# EAGLE design Displayduino_2_0 (EAGLE 4.16)
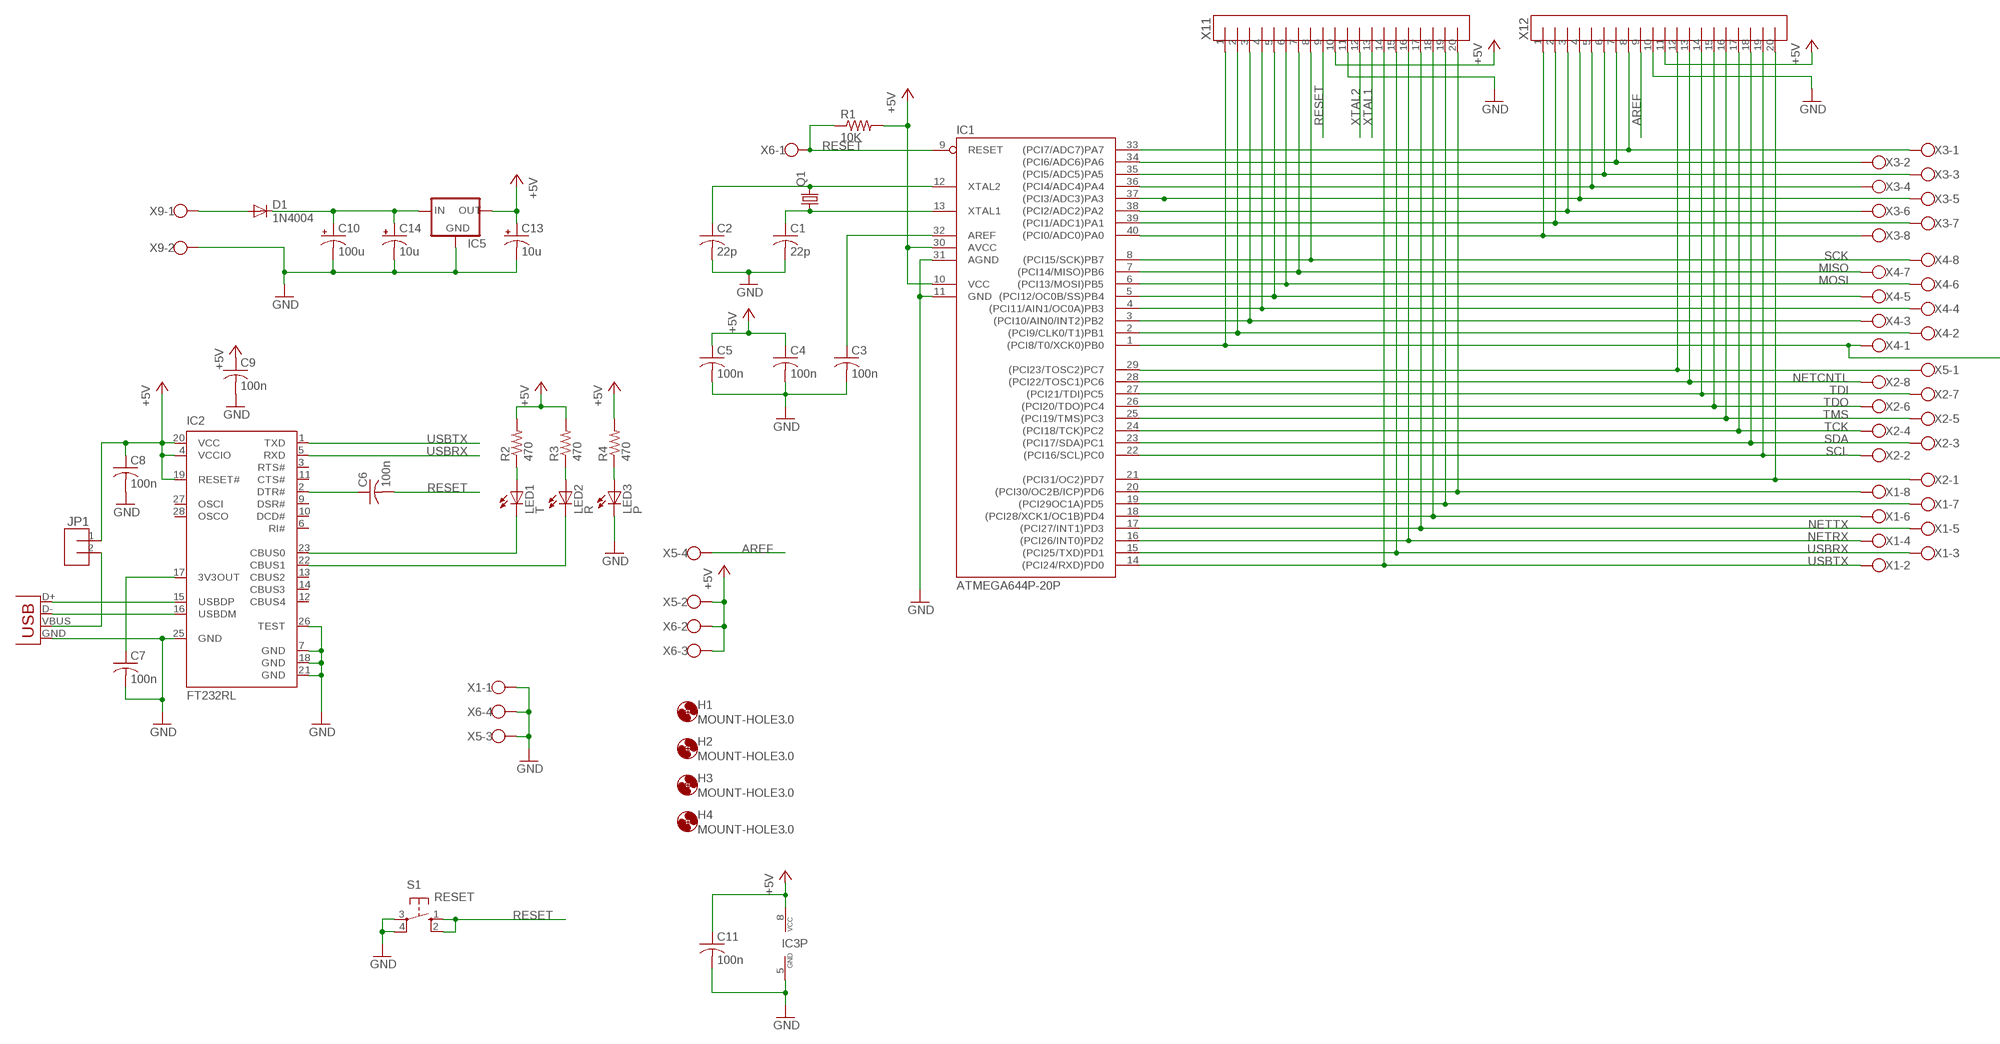
[diagram p0: schematic, sheet 1, part 1 of 2]
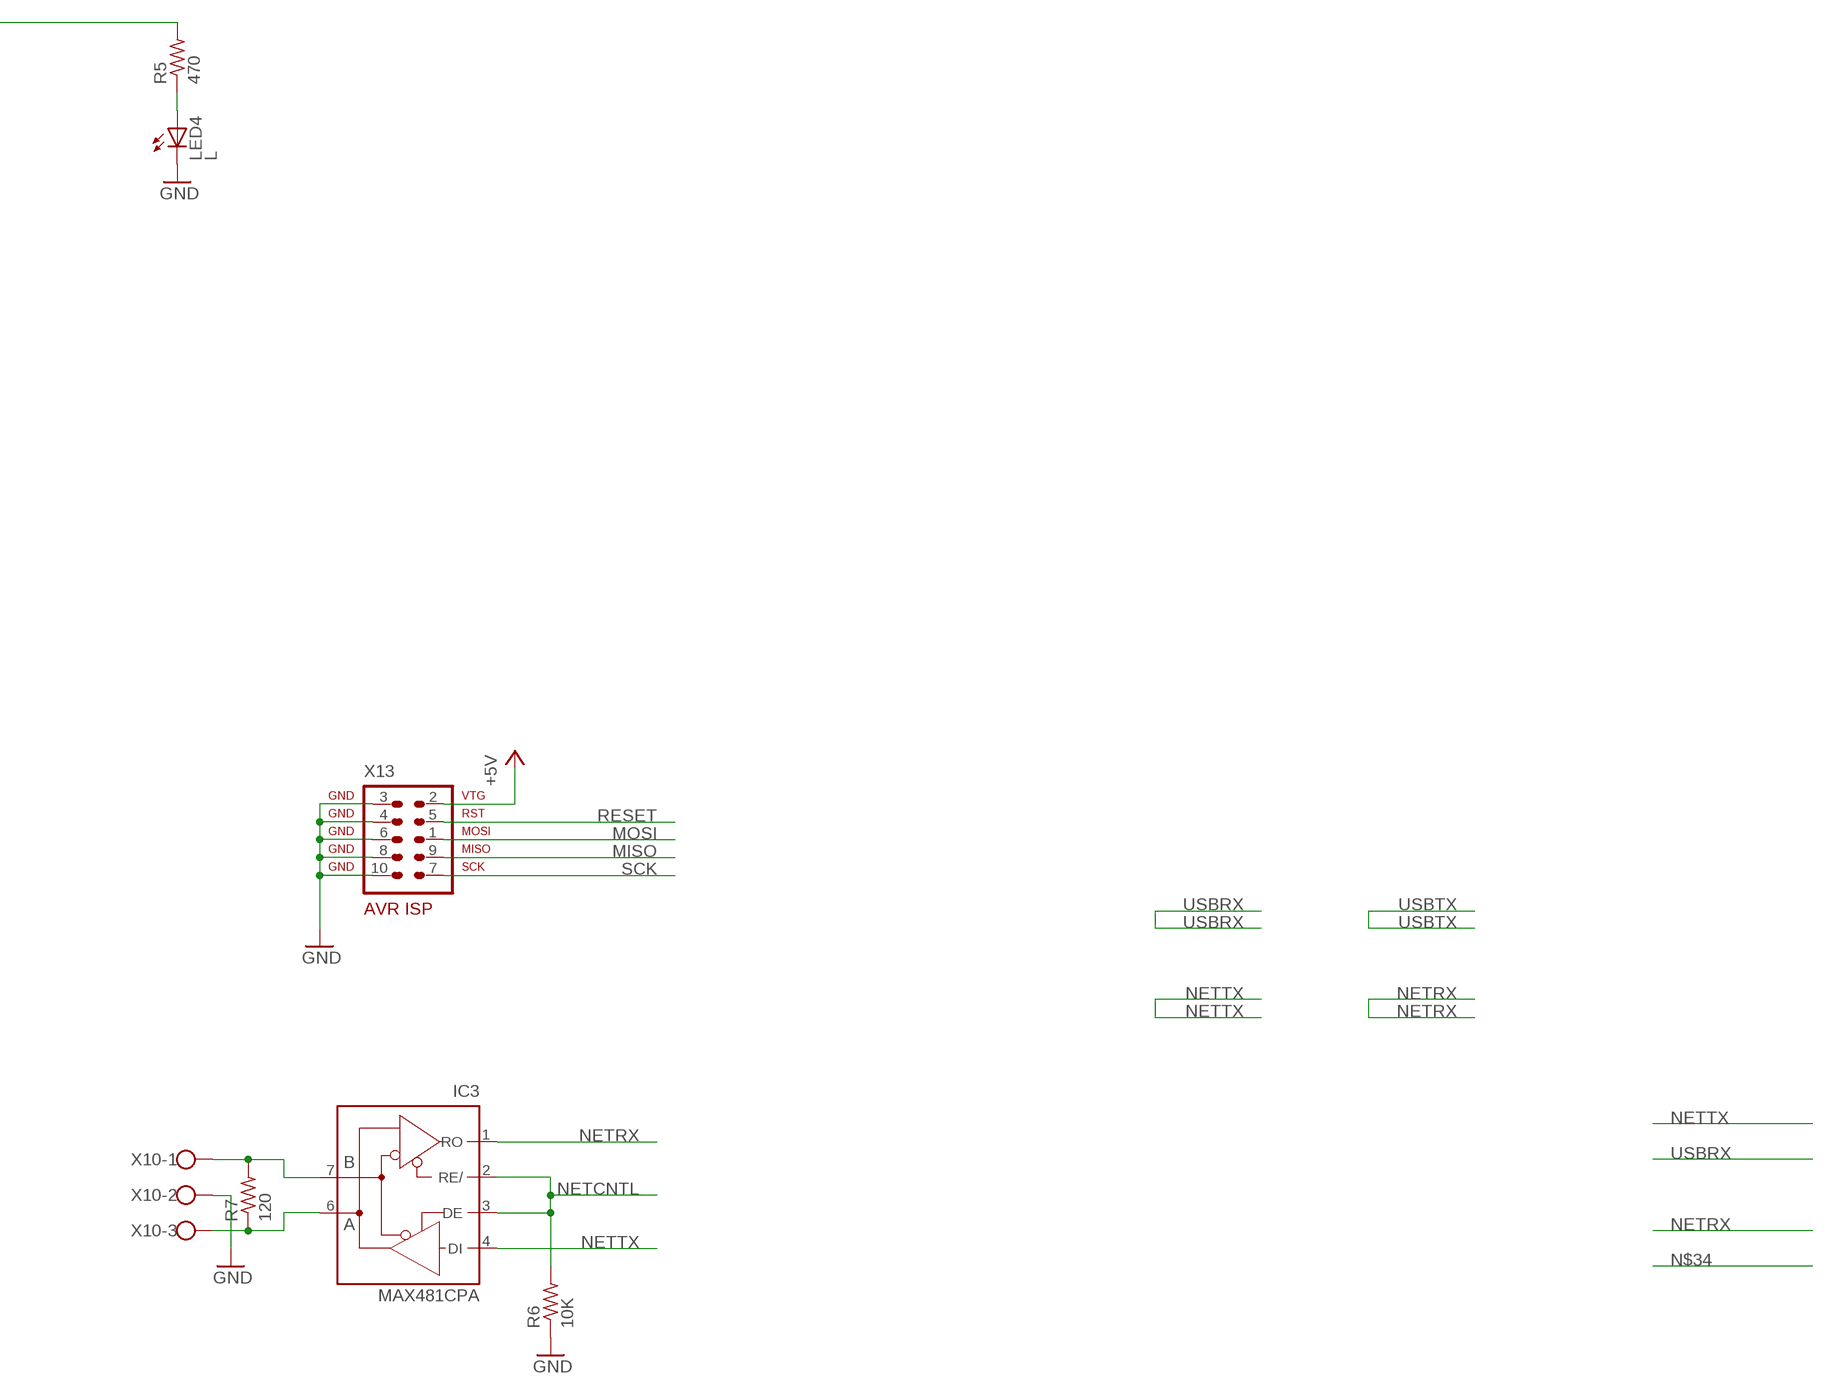
[diagram p1: schematic, sheet 1, part 2 of 2]

## Parts
C1  22p  C-US025-025X050  [C025-025X050]
C2  22p  C-US025-025X050  [C025-025X050]
C3  100n  C-US050-025X075  [C050-025X075]
C4  100n  C-US050-025X075  [C050-025X075]
C5  100n  C-US050-025X075  [C050-025X075]
C6  100n  C-US050-025X075  [C050-025X075]
C7  100n  C-US050-025X075  [C050-025X075]
C8  100n  C-US050-025X075  [C050-025X075]
C9  100n  C-US050-025X075  [C050-025X075]
C10  100u  CPOL-USE3.5-8  [E3,5-8]
C11  100n  C-US050-025X075  [C050-025X075]
C13  10u  CPOL-USE2.5-5  [E2,5-5]
C14  10u  CPOL-USE2.5-5  [E2,5-5]
D1  1N4004  [DO41-10]
H1  MOUNT-HOLE3.0  [3,0]
H2  MOUNT-HOLE3.0  [3,0]
H3  MOUNT-HOLE3.0  [3,0]
H4  MOUNT-HOLE3.0  [3,0]
IC1  ATMEGA644P-20P  ATMEGA644-20P  [DIL40]
IC2  FT232RL  [SSOP28]
IC3  MAX481CPA  [DIL08]
IC5  LM1117V  [78XXS]
JP1  M02-100MIL  [100MIL-2]
LED1  T  LED3MM  [LED3MM]
LED2  R  LED3MM  [LED3MM]
LED3  P  LED3MM  [LED3MM]
LED4  L  LED3MM  [LED3MM]
Q1  CRYSTALHC49S  [HC49/S]
R1  10K  R-US_0207/15  [0207/15]
R2  470  R-US_0207/10  [0207/10]
R3  470  R-US_0207/10  [0207/10]
R4  470  R-US_0207/10  [0207/10]
R5  470  R-US_0207/10  [0207/10]
R6  10K  R-US_0207/10  [0207/10]
R7  120  R-US_0207/10  [0207/10]
S1  RESET  10-XX  [B3F-10XX]
X1  W237-08P  [W237-8P]
X2  W237-08P  [W237-8P]
X3  W237-08P  [W237-8P]
X4  W237-08P  [W237-8P]
X5  W237-04P  [W237-4P]
X6  W237-04P  [W237-4P]
X8  USBPTH  [USB-B-PTH]
X9  W237-02P  [W237-132]
X10  W237-3E  [W237-3E]
X11  M20-100MIL  [100MIL-20]
X12  M20-100MIL  [100MIL-20]
X13  AVR-ISP-10ML  [ML10]

## Nets
+5V: C4.1 C5.1 C8.1 C9.1 C11.1 C13.+ IC1.10(VCC) IC1.30(AVCC) IC2.4(VCCIO) IC2.19(RESET#) IC2.20(VCC) IC3.8(VCC) IC5.GND(OUT) JP1.1 R1.2 R2.2 R3.2 R4.2 X5.2 X6.2 X6.3 X11.10 X12.11 X13.2
AREF: C3.1 IC1.32(AREF) X5.4 X12.9
GND: C1.2 C2.2 C3.2 C4.2 C5.2 C7.2 C8.2 C9.2 C10.- C11.2 C13.- C14.- IC1.11(GND) IC1.31(AGND) IC2.7(GND) IC2.18(GND) IC2.21(GND) IC2.25(GND) IC2.26(TEST) IC3.5(GND) IC5.IN(GND) LED3.K(C) LED4.K(C) R6.1 S1.3(P) S1.4(P1) X1.1 X5.3 X6.4 X8.GND X9.2 X10.2 X11.11 X12.10 X13.3 X13.4 X13.6 X13.8 X13.10
MISO: IC1.7((PCI14/MISO)PB6) X4.7 X11.7 X13.9
MOSI: IC1.6((PCI13/MOSI)PB5) X4.6 X11.6 X13.1
N$1: IC1.20((PCI30/OC2B/ICP)PD6) X1.8 X11.20
N$2: IC1.19((PCI29OC1A)PD5) X1.7 X11.19
N$3: IC1.18((PCI28/XCK1/OC1B)PD4) X1.6 X11.18
N$4: IC2.15(USBDP) X8.D+
N$5: IC2.16(USBDM) X8.D-
N$6: LED1.A R2.1
N$7: C7.1 IC2.17(3V3OUT)
N$8: IC1.21((PCI31/OC2)PD7) X2.1 X12.20
N$9: LED2.A R3.1
N$11: IC2.23(CBUS0) LED1.K(C)
N$12: IC2.22(CBUS1) LED2.K(C)
N$13: LED3.A R4.1
N$14: LED4.A R5.1
N$15: JP1.2 X8.VBUS
N$16: IC1.33((PCI7/ADC7)PA7) X3.1 X12.8
N$17: IC1.34((PCI6/ADC6)PA6) X3.2 X12.7
N$18: IC1.35((PCI5/ADC5)PA5) X3.3 X12.6
N$19: IC1.36((PCI4/ADC4)PA4) X3.4 X12.5
N$20: IC1.37((PCI3/ADC3)PA3) X3.5 X12.4
N$21: IC1.38((PCI2/ADC2)PA2) X3.6 X12.3
N$22: IC1.39((PCI1/ADC1)PA1) X3.7 X12.2
N$23: IC1.40((PCI0/ADC0)PA0) X3.8 X12.1
N$24: IC1.1((PCI8/T0/XCK0)PB0) R5.2 X4.1 X11.1
N$25: IC1.2((PCI9/CLK0/T1)PB1) X4.2 X11.2
N$26: IC1.3((PCI10/AIN0/INT2)PB2) X4.3 X11.3
N$27: IC1.4((PCI11/AIN1/OC0A)PB3) X4.4 X11.4
N$28: IC1.5((PCI12/OC0B/SS)PB4) X4.5 X11.5
N$29: D1.A X9.1
N$32: IC1.29((PCI23/TOSC2)PC7) X5.1 X12.12
N$33: C6.1 IC2.2(DTR#)
N$104: C10.+ C14.+ D1.C IC5.OUT(IN)
NETCNTL: IC1.28((PCI22/TOSC1)PC6) IC3.2(RE/) IC3.3(DE) R6.2 X2.8 X12.13
NETRX: IC1.16((PCI26/INT0)PD2) IC3.1(RO) X1.4 X11.16
NETTX: IC1.17((PCI27/INT1)PD3) IC3.4(DI) X1.5 X11.17
RESET: C6.2 IC1.9(RESET) R1.1 S1.1(S) S1.2(S1) X6.1 X11.9 X13.5
RS485A: IC3.6(A) R7.1 X10.3
RS485B: IC3.7(B) R7.2 X10.1
SCK: IC1.8((PCI15/SCK)PB7) X4.8 X11.8 X13.7
SCL: IC1.22((PCI16/SCL)PC0) X2.2 X12.19
SDA: IC1.23((PCI17/SDA)PC1) X2.3 X12.18
TCK: IC1.24((PCI18/TCK)PC2) X2.4 X12.17
TDI: IC1.27((PCI21/TDI)PC5) X2.7 X12.14
TDO: IC1.26((PCI20/TDO)PC4) X2.6 X12.15
TMS: IC1.25((PCI19/TMS)PC3) X2.5 X12.16
USBRX: IC1.15((PCI25/TXD)PD1) IC2.5(RXD) X1.3 X11.15
USBTX: IC1.14((PCI24/RXD)PD0) IC2.1(TXD) X1.2 X11.14
XTAL1: C1.1 IC1.13(XTAL1) Q1.1 X11.13
XTAL2: C2.1 IC1.12(XTAL2) Q1.2 X11.12
Unconnected: IC2.3(RTS#) IC2.6(RI#) IC2.9(DSR#) IC2.10(DCD#) IC2.11(CTS#) IC2.12(CBUS4) IC2.13(CBUS2) IC2.14(CBUS3) IC2.27(OSCI) IC2.28(OSCO)

## Library data of the parts
C1-C9 C11 = rcl:C-US: CAPACITOR, American symbol
C10 C13 C14 = rcl:CPOL-US: POLARIZED CAPACITOR, American symbol
D1 = diode:1N4004: DIODE general purpose rectifier, 1 A
H1-H4 = holes:MOUNT-HOLE: MOUNTING HOLE with drill center marker
IC1 = avr:ATMEGA644*P: MICROCONTROLLER 64 kBytes FLASH 4 kBytes SRAM 2 kBytes EEPROM DUAL USART 8-channel 10 bit ADC
IC2 = ftdichip:FT232R: Source: http://www.ftdichip.com/Documents/DataSheets/DS_FT232R_v104.pdf
IC3 = maxim:MAX481CPA: RS485 TRANSEIVER
IC5 = v-reg-3:LM1117
JP1 = rbg-generic-headers:M02-100MIL
LED1-LED4 = led:LED: LED OSRAM: - CHIPLED LG R971, LG N971, LY N971, LG Q971, LY Q971, LO R971, LY R971 LH N974, LH R974 LS Q976, LO Q976, LY Q976 LO Q996 - Hyper CHIPLED LW Q18S LB Q993, LB Q99A, LB R99A - SideLED LS A670, LO A670, LY A670, LG A670, LP A670 LB A673, LV A673, LT A673, LW A673 LH A674 LY A675 LS A676, LA A676, LO A676, LY A676, LW A676 LS A679, LY A679, LG A679 - Hyper Micro SIDELED® LS Y876, LA Y876, LO Y876, LY Y876 LT Y87S - SmartLED LW L88C, LW L88S LB L89C, LB L89S, LG L890 LS L89K, LO L89K, LY L89K LS L896, LA L896, LO L896, LY L896 - TOPLED LS T670, LO T670, LY T670, LG T670, LP T670 LSG T670, LSP T670, LSY T670, LOP T670, LYG T670 LG T671, LOG T671, LSG T671 LB T673, LV T673, LT T673, LW T673 LH T674 LS T676, LA T676, LO T676, LY T676, LB T676, LH T676, LSB T676, LW T676 LB T67C, LV T67C, LT T67C, LS T67K, LO T67K, LY T67K, LW E67C LS E67B, LA E67B, LO E67B, LY E67B, LB E67C, LV E67C, LT E67C LW T67C LS T679, LY T679, LG T679 LS T770, LO T770, LY T770, LG T770, LP T770 LB T773, LV T773, LT T773, LW T773 LH T774 LS E675, LA E675, LY E675, LS T675 LS T776, LA T776, LO T776, LY T776, LB T776 LHGB T686 LT T68C, LB T68C - Hyper Mini TOPLED® LB M676 - Mini TOPLED Santana® LG M470 LS M47K, LO M47K, LY M47K Source: http://www.osram.convergy.de - LUMILED® LXK2-PW12-R00, LXK2-PW12-S00, LXK2-PW14-U00, LXK2-PW14-V00 LXK2-PM12-R00, LXK2-PM12-S00, LXK2-PM14-U00 LXK2-PE12-Q00, LXK2-PE12-R00, LXK2-PE12-S00, LXK2-PE14-T00, LXK2-PE14-U00 LXK2-PB12-K00, LXK2-PB12-L00, LXK2-PB12-M00, LXK2-PB14-N00, LXK2-PB14-P00, LXK2-PB14-Q00 LXK2-PR12-L00, LXK2-PR12-M00, LXK2-PR14-Q00, LXK2-PR14-R00 LXK2-PD12-Q00, LXK2-PD12-R00, LXK2-PD12-S00 LXK2-PH12-R00, LXK2-PH12-S00 LXK2-PL12-P00, LXK2-PL12-Q00, LXK2-PL12-R00 Source: www.luxeon.com
Q1 = crystal:CRYSTAL: CRYSTAL
R1-R7 = rcl:R-US_: RESISTOR, American symbol
S1 = switch-omron:10-XX: OMRON SWITCH
X1-X4 = con-wago-508:W237-08P: WAGO SREW CLAMP
X5 X6 = con-wago-508:W237-04P: WAGO SREW CLAMP
X8 = sfe-sparkfun:USB: USB Connectors USB-B-PTH is fully proven SKU : PRT-00139 USB-miniB is fully proven SKU : PRT-00587 USB-A-PCB is untested. USB-A-H is throughly reviewed, but untested. Spark Fun Electronics SKU : PRT-00437 USB-B-SMT is throughly reviewed, but untested. Needs silkscreen touching up. USB-A-S has not been used/tested USB-MB-H has not been used/tested
X9 = con-wago-508:W237-02P: WAGO SREW CLAMP
X10 = con-wago-508:W237-3E: WAGO SREW CLAMP
X11 X12 = rbg-generic-headers:M20-100MIL
X13 = atmel-1:AVR-ISP-10: AVR ISP-10 Serial Programming Header

## Board
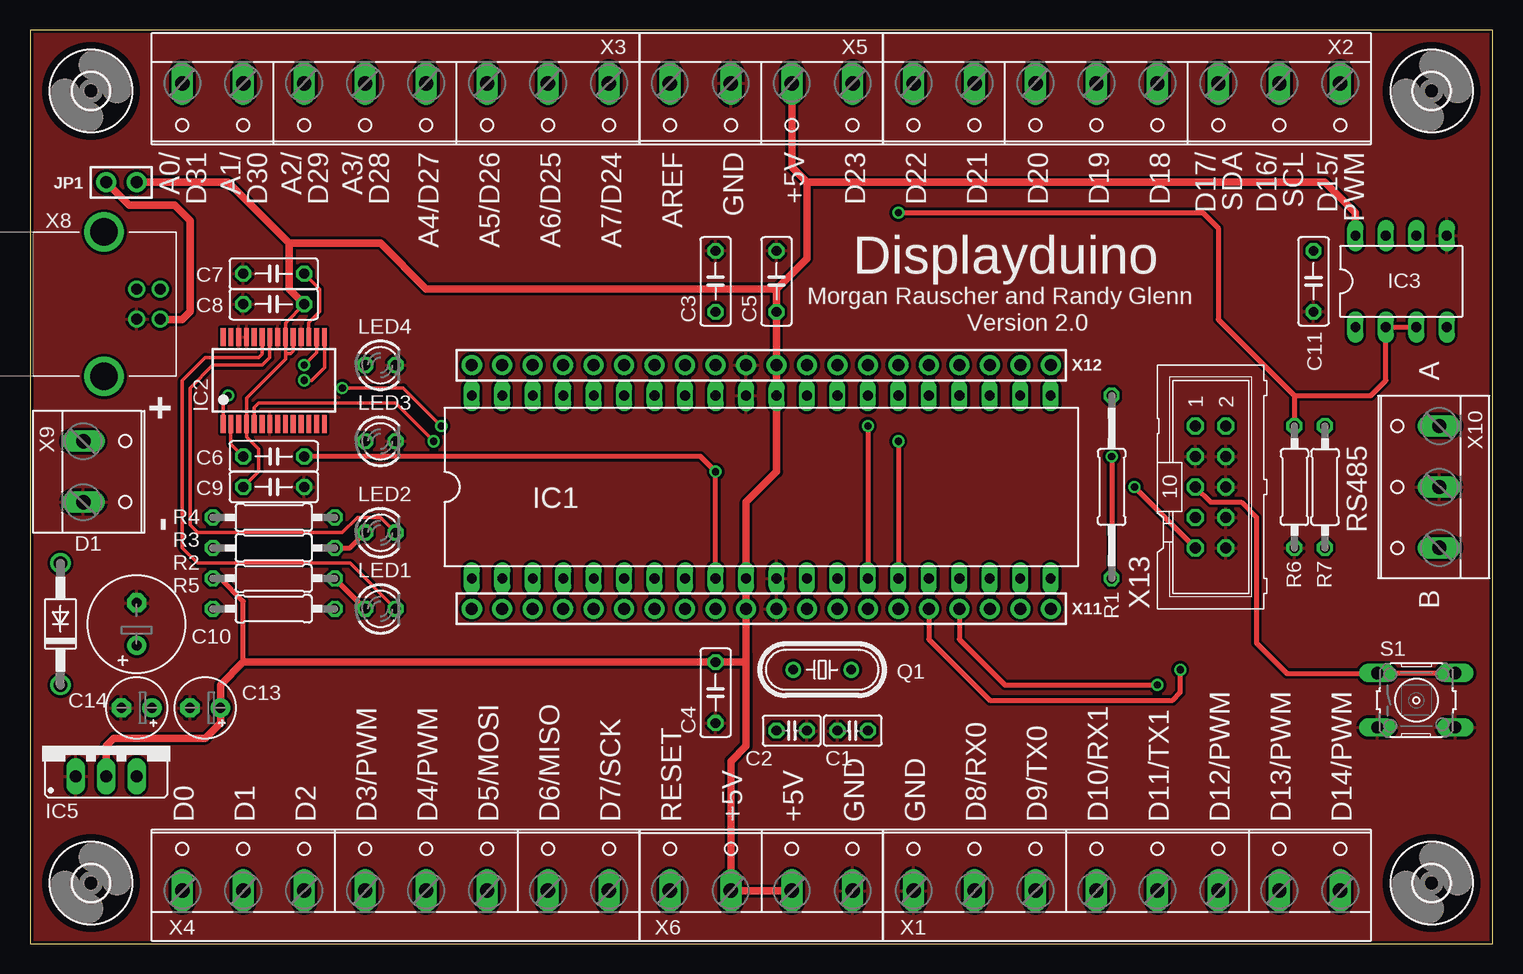
[diagram p2: board, top side]
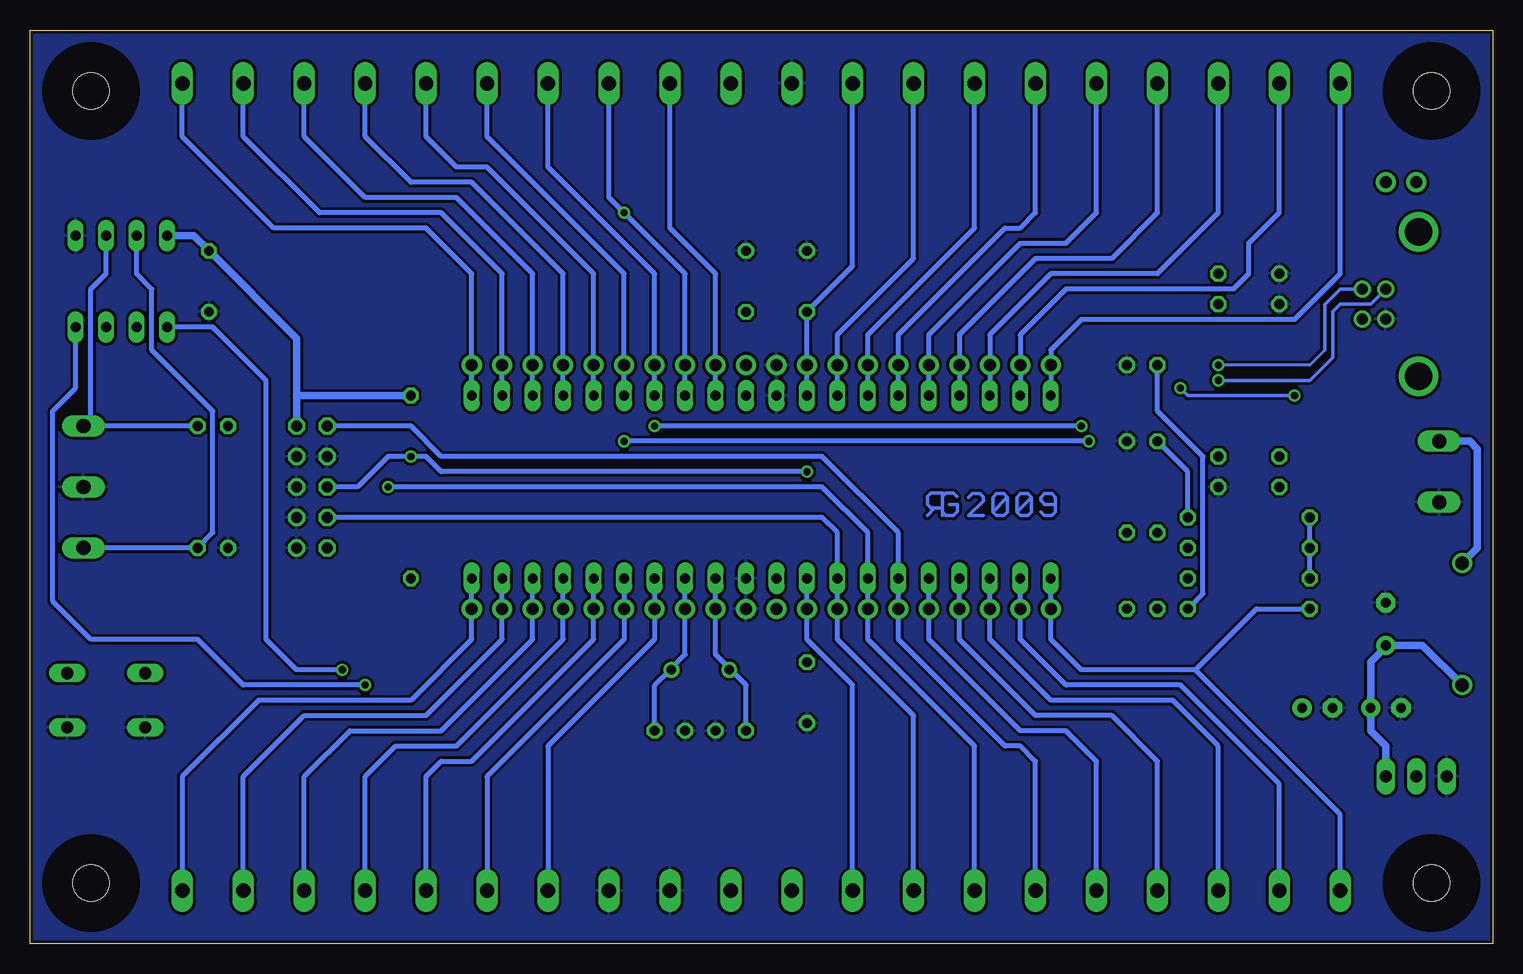
[diagram p3: board, bottom side, seen from below]

Size 121.92 x 76.2 mm. Coordinates in mm from the lower left corner, seen from the top.
Outline: 0,0 121.92,0 121.92,76.2 0,76.2 0,0
Copper layers (1*16): Top 0.035mm / dielectric 1.5mm / Bottom 0.035mm
Design rules "default": minimum track width 10mil, minimum drill 22mil, track to track 9mil, track to pad 9mil, pad to pad 9mil, via to via 9mil, smd to smd 9mil, copper to edge 10mil, drill to drill 8mil, minimum pad ring 10mil, minimum via ring 8mil, stop-mask expansion 4mil, vias tented up to drill 0mil, thermal gap 10mil

### Footprints (pad centres in the part's own frame; a part is rotated, then mirrored left to right if it is on the bottom)
C025-025X050 = drill 0.813 octagon: 1 -1.27,0; 2 1.27,0
C050-025X075 = drill 0.813 octagon: 1 -2.54,0; 2 2.54,0
E3,5-8 = drill 0.813 pad 1.6 round: + -1.778,0 | drill 0.813 pad 1.6 octagon: - 1.778,0
E2,5-5 = drill 0.813 pad 1.6 round: + -1.27,0 | drill 0.813 pad 1.6 octagon: - 1.27,0
DO41-10 = drill 1.118 round: A 5.08,0; C -5.08,0
3,0 = hole 3: 0,0
DIL40 = drill 0.813 long: 1 -24.13,-7.62; 2 -21.59,-7.62; 3 -19.05,-7.62; 4 -16.51,-7.62; 5 -13.97,-7.62; 6 -11.43,-7.62; 7 -8.89,-7.62; 8 -6.35,-7.62; 9 -3.81,-7.62; 10 -1.27,-7.62; 11 1.27,-7.62; 12 3.81,-7.62; 13 6.35,-7.62; 14 8.89,-7.62; 15 11.43,-7.62; 16 13.97,-7.62; 17 16.51,-7.62; 18 19.05,-7.62; 19 21.59,-7.62; 20 24.13,-7.62; 21 24.13,7.62; 22 21.59,7.62; 23 19.05,7.62; 24 16.51,7.62; 25 13.97,7.62; 26 11.43,7.62; 27 8.89,7.62; 28 6.35,7.62; 29 3.81,7.62; 30 1.27,7.62; 31 -1.27,7.62; 32 -3.81,7.62; 33 -6.35,7.62; 34 -8.89,7.62; 35 -11.43,7.62; 36 -13.97,7.62; 37 -16.51,7.62; 38 -19.05,7.62; 39 -21.59,7.62; 40 -24.13,7.62
SSOP28 = smd 0.4 x 1.5: 1 -4.225,-3.625; 2 -3.575,-3.625; 3 -2.925,-3.625; 4 -2.275,-3.625; 5 -1.625,-3.625; 6 -0.975,-3.625; 7 -0.325,-3.625; 8 0.325,-3.625; 9 0.975,-3.625; 10 1.625,-3.625; 11 2.275,-3.625; 12 2.925,-3.625; 13 3.575,-3.625; 14 4.225,-3.625; 15 4.225,3.625; 16 3.575,3.625; 17 2.925,3.625; 18 2.275,3.625; 19 1.625,3.625; 20 0.975,3.625; 21 0.325,3.625; 22 -0.325,3.625; 23 -0.975,3.625; 24 -1.625,3.625; 25 -2.275,3.625; 26 -2.925,3.625; 27 -3.575,3.625; 28 -4.225,3.625
DIL08 = drill 0.813 long: 1 -3.81,-3.81; 2 -1.27,-3.81; 3 1.27,-3.81; 4 3.81,-3.81; 5 3.81,3.81; 6 1.27,3.81; 7 -1.27,3.81; 8 -3.81,3.81
78XXS = drill 1.016 long: GND 0,-2.54; IN -2.54,-2.54; OUT 2.54,-2.54
100MIL-2 = drill 1 pad 1.676 round: 1 -1.27,0; 2 1.27,0
LED3MM = drill 0.813 octagon: A -1.27,0; K 1.27,0
HC49/S = drill 0.813 round: 1 -2.413,0; 2 2.413,0
0207/15 = drill 0.813 octagon: 1 -7.62,0; 2 7.62,0
0207/10 = drill 0.813 octagon: 1 -5.08,0; 2 5.08,0
B3F-10XX = drill 1.016 long: 1 -3.251,2.261; 2 3.251,2.261; 3 -3.251,-2.261; 4 3.251,-2.261
W237-8P = drill 1.194 long: 1 -17.78,-0.635; 2 -12.7,-0.635; 3 -7.62,-0.635; 4 -2.54,-0.635; 5 2.54,-0.635; 6 7.62,-0.635; 7 12.7,-0.635; 8 17.78,-0.635
W237-4P = drill 1.194 long: 1 -7.62,-0.635; 2 -2.54,-0.635; 3 2.54,-0.635; 4 7.62,-0.635
USB-B-PTH = drill 0.914 round: D+ 0,1.25; D- 1.981,1.25; GND 0,-1.25; VBUS 1.981,-1.25 | drill 2.286 round: P$1 -2.718,-6.02; P$2 -2.718,6.02
W237-132 = drill 1.194 long: 1 -2.54,-0.635; 2 2.54,-0.635
W237-3E = drill 1.194 long: 1 -5.08,-0.635; 2 0,-0.635; 3 5.08,-0.635
100MIL-20 = drill 1 pad 1.676 round: 1 -24.13,0; 2 -21.59,0; 3 -19.05,0; 4 -16.51,0; 5 -13.97,0; 6 -11.43,0; 7 -8.89,0; 8 -6.35,0; 9 -3.81,0; 10 -1.27,0; 11 1.27,0; 12 3.81,0; 13 6.35,0; 14 8.89,0; 15 11.43,0; 16 13.97,0; 17 16.51,0; 18 19.05,0; 19 21.59,0; 20 24.13,0
ML10 = drill 0.914 octagon: 1 -5.08,-1.27; 2 -5.08,1.27; 3 -2.54,-1.27; 4 -2.54,1.27; 5 0,-1.27; 6 0,1.27; 7 2.54,-1.27; 8 2.54,1.27; 9 5.08,-1.27; 10 5.08,1.27

### Placement (x,y rotation side)
C1  68.58,17.78 180 top
C2  63.5,17.78 0 top
C3  57.15,55.24 90 top
C4  57.15,20.95 270 top
C5  62.23,55.24 90 top
C6  20.32,40.64 0 top
C7  20.32,55.88 180 top
C8  20.32,53.34 180 top
C9  20.32,38.1 0 top
C10  8.89,26.67 90 top
C11  107,55.24 270 top
C13  14.61,19.68 180 top
C14  8.89,19.68 180 top
D1  2.54,26.67 90 top
H1  5.08,5.08 0 top
H2  116.84,5.08 0 top
H3  5.08,71.12 0 top
H4  116.84,71.12 0 top
IC1  60.96,38.1 0 top
IC2  20.32,46.99 0 top
IC3  114.3,55.24 0 top
IC5  6.35,16.51 0 top
JP1  7.62,63.5 180 top
LED1  29.21,27.94 0 top
LED2  29.21,34.29 0 top
LED3  29.21,41.91 0 top
LED4  29.21,48.26 0 top
Q1  66.04,22.86 180 top
R1  90.17,38.1 90 top
R2  20.32,30.48 180 top
R3  20.32,33.02 180 top
R4  20.32,35.56 180 top
R5  20.32,27.94 180 top
R6  105.41,38.1 90 top
R7  107.95,38.1 270 top
S1  115.57,20.32 0 top
U$1  [RGLOGO_SMALL_2009]  45.72,35.56 0 bottom
X1  91.44,5.08 0 top
X2  91.44,71.12 180 top
X3  30.48,71.12 180 top
X4  30.48,5.08 0 top
X5  60.96,71.12 180 top
X6  60.96,5.08 0 top
X8  8.89,53.34 0 top
X9  5.08,39.37 270 top
X10  116.84,38.1 90 top
X11  60.96,27.94 0 top
X12  60.96,48.26 0 top
X13  98.42,38.1 270 top

### Tracks (layer width: path | path; a pad name or v marks a point on that pad's centre or on a via)
+5V
  Top 0.305: C9.1 19.05,39.37 19.05,41.27 18.05,42.28 IC2.4 18.05,45.51 21.3,48.76 21.3,49.21 | C8.1 21.3,51.77 IC2.20 21.3,49.21 | 21.3,49.21 21.75,49.21 21.95,49.41 IC2.19
  Top 0.406: R2.2 15.88,30.48 17.78,28.57 17.78,23.5
  Top 0.61: 59.69,24.13 59.69,23.5 C4.1 17.78,23.5 15.88,21.59 C13.+ 15.88,18.41 14.61,17.14 6.99,17.14 6.35,16.51 IC5.GND | 59.69,24.13 X11.10 | X11.10 IC1.10 | IC1.10 59.69,36.83 62.23,39.37 IC1.30 X12.11 C5.1 62.23,54.61 | 62.23,54.61 33.02,54.61 29.21,58.42 21.59,58.42 | 21.59,58.42 21.59,54.61 C8.1 | 62.23,54.61 64.77,57.15 64.77,63.5 | 64.77,63.5 63.5,64.77 X5.2 | 59.69,24.13 59.69,16.51 58.42,15.24 X6.2 X6.3 | X11.10 IC1.10 | 64.77,63.5 107.95,63.5 110.49,60.96 IC3.8 | 21.59,58.42 16.51,63.5 JP1.1
  Bottom 0.406: R4.2 R3.2 R2.2
  Bottom 0.61: IC3.8 108.27,59.05 C11.1 99.69,50.48 99.69,45.72 | 99.69,45.72 X13.2 | 99.69,45.72 R1.2
AREF
  Bottom 0.406: X5.4 53.34,56.52 C3.1 X12.9 IC1.32
GND
  pour Top: -1.27,77.47 123.19,77.47 123.19,-1.27 -1.27,-1.27
  pour Bottom: -1.27,77.47 123.19,77.47 123.19,-1.27 -1.27,-1.27
MISO  (via drill 0.6)
  Top 0.406: v92.08,38.1 X13.9
  Bottom 0.406: X4.7 43.18,16.51 52.07,25.4 X11.7 | X11.7 IC1.7 | v92.08,38.1 55.88,38.1 52.07,34.29 IC1.7 | X11.7 IC1.7
MOSI
  Bottom 0.406: X4.6 38.1,15.24 39.37,16.51 40.64,16.51 49.53,25.4 X11.6 | X11.6 IC1.6 | IC1.6 49.53,34.29 55.88,40.64 87.63,40.64 90.17,43.18 X13.1 | X11.6 IC1.6
N$1
  Bottom 0.406: X1.8 109.22,13.97 102.87,20.32 90.17,20.32 85.09,25.4 X11.20 | X11.20 IC1.20 X11.20
N$2
  Bottom 0.406: X1.7 104.14,13.97 99.06,19.05 88.9,19.05 82.55,25.4 X11.19 | X11.19 IC1.19 X11.19
N$3
  Bottom 0.406: X1.6 99.06,13.97 95.25,17.78 87.63,17.78 80.01,25.4 X11.18 | X11.18 IC1.18 X11.18
N$4  (via drill 0.6)
  Top 0.305: v22.86,46.99 23.5,46.99 24.55,48.04 IC2.15
  Bottom 0.305: v22.86,46.99 15.24,46.99 13.34,48.9 13.34,52.7 12.7,53.34 10.16,53.34 8.91,54.59 X8.D+
N$5  (via drill 0.6)
  Top 0.305: IC2.16 23.89,49.3 v22.86,48.26
  Bottom 0.254: v22.86,48.26 15.24,48.26 13.99,49.51
  Bottom 0.305: 13.99,49.51 13.99,53.32 12.7,54.61 10.79,54.61 10.81,54.59 X8.D-
N$6
  Top 0.406: LED1.A R2.1
N$7
  Top 0.305: IC2.17 23.25,51.82 24.13,52.7 24.13,54.61 C7.1
N$8
  Bottom 0.406: IC1.21 X12.20 85.09,55.88 88.9,59.69 101.6,59.69 109.22,67.31 X2.1
N$9
  Top 0.406: R3.1 26.67,33.02 LED2.A
N$11
  Top 0.305: IC2.23 19.34,49.19 19.05,48.9 14.61,48.9 12.7,46.99 12.7,33.02 13.97,31.75 26.67,31.75 LED1.K
N$12
  Top 0.305: IC2.22 20,48.89 19.37,48.26 15.24,48.26 13.34,46.35 13.34,34.92 13.97,34.29 26.04,34.29 27.3,35.56 29.21,35.56 LED2.K
N$13
  Bottom 0.406: R4.1 25.4,39.37 LED3.A
N$14
  Bottom 0.406: LED4.A 27.94,44.45 24.13,40.64 24.13,29.21 R5.1
N$15
  Top 0.61: JP1.2 8.26,61.59 12.06,61.59 13.34,60.33 13.34,52.7 12.7,52.07 10.79,52.07 10.81,52.09 X8.VBUS
N$16
  Bottom 0.406: X3.1 48.26,57.15 54.61,50.8 X12.8 IC1.33
N$17
  Bottom 0.406: X3.2 43.18,59.69 52.07,50.8 X12.7 IC1.34
N$18
  Bottom 0.406: X3.3 38.1,60.96 39.37,59.69 40.64,59.69 49.53,50.8 X12.6 IC1.35
N$19
  Bottom 0.406: X3.4 33.02,60.96 35.56,58.42 39.37,58.42 46.99,50.8 X12.5 IC1.36
N$20
  Bottom 0.406: X3.5 27.94,60.96 31.75,57.15 38.1,57.15 44.45,50.8 X12.4 | X12.4 IC1.37 X12.4
N$21
  Bottom 0.406: X3.6 22.86,60.96 27.94,55.88 36.83,55.88 41.91,50.8 X12.3 | X12.3 IC1.38 X12.3
N$22
  Bottom 0.406: X3.7 17.78,60.96 20.32,58.42 20.32,55.88 21.59,54.61 35.56,54.61 39.37,50.8 X12.2 | X12.2 IC1.39 X12.2
N$23
  Bottom 0.406: IC1.40 X12.1 36.83,49.53 34.29,52.07 16.51,52.07 12.7,55.88 X3.8
N$24
  Bottom 0.406: X11.1 36.83,25.4 34.29,22.86 24.77,22.86 | X11.1 IC1.1 X11.1 | X4.1 12.7,10.79 24.77,22.86 | 24.77,22.86 19.68,27.94 R5.2
N$25
  Bottom 0.406: X11.2 39.37,25.4 35.56,21.59 26.04,21.59 17.78,13.34 X4.2 | X11.2 IC1.2 X11.2
N$26
  Bottom 0.406: X4.3 22.86,16.51 26.67,20.32 36.83,20.32 41.91,25.4 X11.3 | X11.3 IC1.3 X11.3
N$27
  Bottom 0.406: X4.4 27.94,15.24 31.75,19.05 38.1,19.05 44.45,25.4 X11.4 | X11.4 IC1.4 X11.4
N$28
  Bottom 0.406: X4.5 33.02,15.24 35.56,17.78 39.37,17.78 46.99,25.4 X11.5 | X11.5 IC1.5 X11.5
N$29
  Bottom 0.61: X9.1 1.91,41.91 1.27,41.27 1.27,33.02 D1.A
N$32
  Bottom 0.406: X5.1 68.58,59.69 64.77,55.88 X12.12 IC1.29
N$33
  Top 0.305: IC2.2 16.75,41.67 C6.1
N$104
  Bottom 0.61: D1.C 5.84,24.89 C10.+ 8.89,24.77 10.16,23.5 C14.+ 10.16,17.78 8.89,16.51 IC5.OUT
NETCNTL  (via drill 0.6)
  Top 0.406: IC3.3 IC3.2 113.03,46.99 111.76,45.72 105.41,45.72 | 105.41,45.72 R6.2 | 105.41,45.72 99.06,52.07 99.06,59.69 97.79,60.96 v72.39,60.96
  Bottom 0.406: X2.8 73.66,62.23 v72.39,60.96 67.31,55.88 X12.13 IC1.28
NETRX  (via drill 0.6)
  Top 0.406: v95.89,22.86 95.89,20.95 95.25,20.32 80.01,20.32 74.93,25.4 X11.16
  Bottom 0.406: IC3.1 106.68,51.44 102.23,46.99 102.23,25.4 99.69,22.86 v95.89,22.86 | X1.4 88.9,13.97 87.63,15.24 85.09,15.24 74.93,25.4 X11.16 | X11.16 IC1.16 X11.16
NETTX  (via drill 0.6)
  Top 0.406: v93.98,21.59 81.28,21.59 77.47,25.4 X11.17
  Bottom 0.406: v93.98,21.59 104.14,21.59 107.95,25.4 116.84,25.4 120.02,28.57 120.02,44.45 118.11,46.35 IC3.4 | X1.5 93.98,13.97 91.44,16.51 86.36,16.51 80.01,22.86 77.47,25.4 X11.17 | X11.17 IC1.17 X11.17
RESET  (via drill 0.6)
  Top 0.406: v90.17,40.64 R1.1 | IC1.9 v57.15,39.37 55.88,40.64 C6.2 | X13.5 98.42,36.83 100.97,36.83 102.23,35.56 102.23,25.08 104.78,22.54 112.39,22.54 112.36,22.58 S1.1 118.87,22.58 | 118.87,22.58 S1.2 | 118.87,22.58 118.9,22.54
  Bottom 0.406: X6.1 53.34,21.59 57.15,25.4 X11.9 | X11.9 IC1.9 X11.9 | X13.5 94.61,38.1 92.08,40.64 v90.17,40.64 88.9,40.64 87.63,39.37 v57.15,39.37
RS485A
  Bottom 0.406: IC3.6 115.57,55.88 116.84,54.61 116.84,43.18 X10.3 | X10.3 117.79,43.18 | R7.1 X10.3
RS485B
  Bottom 0.406: X10.1 R7.2 106.68,34.29 106.68,44.45 111.76,49.53 111.76,54.61 113.03,55.88 IC3.7
SCK
  Bottom 0.406: X4.8 48.26,19.05 54.61,25.4 X11.8 | X11.8 IC1.8 | IC1.8 54.61,34.29 55.88,35.56 X13.7 | X11.8 IC1.8
SCL
  Bottom 0.406: X2.2 104.14,67.31 97.79,60.96 87.63,60.96 82.55,55.88 X12.19 IC1.22
SDA
  Bottom 0.406: X2.3 99.06,67.31 93.98,62.23 86.36,62.23 80.01,55.88 X12.18 IC1.23
TCK
  Bottom 0.406: X2.4 93.98,67.31 90.17,63.5 85.09,63.5 77.47,55.88 X12.17 IC1.24
TDI
  Bottom 0.406: X2.7 78.74,64.77 69.85,55.88 X12.14 IC1.27
TDO
  Bottom 0.406: X2.6 83.82,67.31 72.39,55.88 X12.15 IC1.26
TMS
  Bottom 0.406: X2.5 88.9,67.31 86.36,64.77 83.82,64.77 74.93,55.88 X12.16 IC1.25
USBRX  (via drill 0.6)
  Top 0.305: IC2.5 18.7,44.73 19.05,45.09 30.48,45.09 v33.66,41.91
  Top 0.406: v72.39,41.91 IC1.15
  Bottom 0.406: v33.66,41.91 v72.39,41.91 | X1.3 83.82,13.97 73.66,24.13 72.39,25.4 X11.15 IC1.15
USBTX  (via drill 0.6)
  Top 0.305: IC2.1 16.09,45.3 v16.51,45.72 | v26.04,46.35 31.11,46.35 v34.29,43.18
  Top 0.406: v69.85,43.18 IC1.14
  Bottom 0.305: v16.51,45.72 25.4,45.72 v26.04,46.35
  Bottom 0.406: v34.29,43.18 v69.85,43.18 | X1.2 78.74,16.51 74.93,20.32 69.85,25.4 X11.14 IC1.14
XTAL1
  Bottom 0.406: X11.13 67.31,24.13 68.58,22.86 | X11.13 IC1.13 X11.13 | 68.58,22.86 Q1.1 | C1.1 69.85,21.59 68.58,22.86
XTAL2
  Bottom 0.406: X11.12 64.77,24.13 63.5,22.86 | X11.12 IC1.12 X11.12 | 63.5,22.86 Q1.2 | C2.1 62.23,21.59 63.5,22.86

### Text on the board
tPlace: A0/ | D31 | A1/ | D30 | A2/ | D29 | A3/ | D28 | A4/D27 | A5/D26 | A6/D25 | A7/D24 | AREF | GND | +5V | D23 | D22 | D21 | D20 | D19 | D18 | D17/ | SDA | D16/ | SCL | D15/ | PWM | Displayduino | A | + | - | RS485 | B | D0 | D1 | D2 | D3/PWM | D4/PWM | D5/MOSI | D6/MISO | D7/SCK | RESET | +5V | +5V | GND | GND | D8/RX0 | D9/TX0 | D10/RX1 | D11/TX1 | D12/PWM | D13/PWM | D14/PWM
tNames: Morgan Rauscher and Randy Glenn | Version 2.0
_tsilk: X3 | X5 | X2 | A0/ | D31 | A1/ | D30 | A2/ | D29 | A3/ | D28 | A4/D27 | A5/D26 | A6/D25 | A7/D24 | AREF | GND | +5V | D23 | D22 | D21 | D20 | D19 | D18 | D17/ | SDA | D16/ | SCL | D15/ | PWM | C7 | Displayduino | IC3 | 100n | 100n | 100n | C8 | 100n | Morgan Rauscher and Randy Glenn | C3 | C5 | LED4 | Version 1.0 | C11 | L | X12 | A | 1 | 2 | LED3 | IC2 | X10 | C6 | P | 10K | 10K | 27K | C9 | 10 | IC1 | LED2 | R4 | 470 | R3 | 470 | R | X7 | R6 | R7 | JP1 | R2 | 470 | LED1 | R5 | 470 | R1 | X13 | B | X9 | + | T | X11 | JP2 | JP4 | S1 | Q1 | JP3 | - | JP5 | C10 | 100n | 100u | C4 | 22p | 22p | C2 | C1 | RESET | D0 | D1 | D2 | D3/PWM | D4/PWM | D5/MOSI | D6/MISO | D7/SCK | RESET | +5V | +5V | GND | GND | D8/RX0 | D9/TX0 | D10/RX1 | D11/TX1 | D12/PWM | D13/PWM | D14/PWM | X4 | X6 | X1